# EAGLE design Djanso_DS_792 (EAGLE 9.6.2)
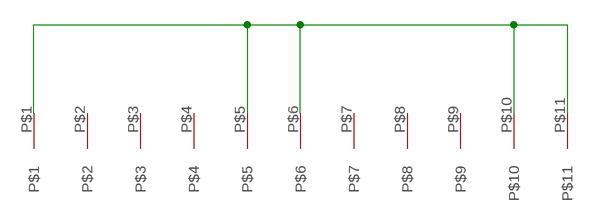
[diagram p0: schematic, sheet 1]

## Parts
U$1  ADVCHIP  [ADCHIP]

## Nets
N$1: U$1.P$1 U$1.P$5 U$1.P$6 U$1.P$10 U$1.P$11
Unconnected: U$1.P$2 U$1.P$3 U$1.P$4 U$1.P$7 U$1.P$8 U$1.P$9

## Library data of the parts
U$1 = advpins:ADVCHIP

## Board
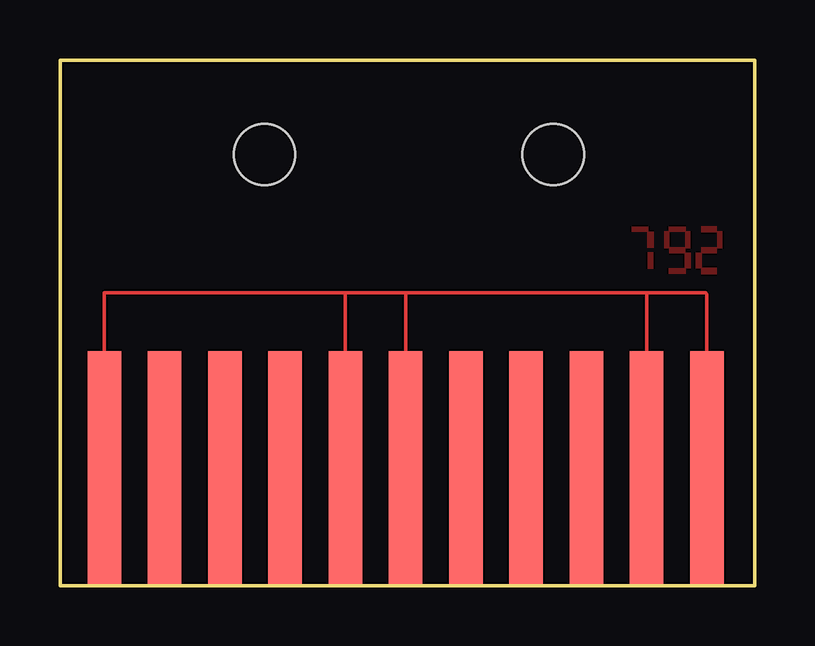
[diagram p1: board, top side]

Size 28.95 x 21.9 mm. Coordinates in mm from the lower left corner, seen from the top.
Outline: 0.05,0 28.95,0 28.95,21.9 0.05,21.9
Outline: 0,0 0,21.9
Copper layers (1*16): Top 0.035mm / dielectric 1.5mm / Bottom 0.035mm
Design rules "default *": minimum track width 6mil, minimum drill 0.35mm, track to track 0.25mil, track to pad 6mil, pad to pad 6mil, via to via 6mil, smd to smd 6mil, copper to edge 0.002540625mm, drill to drill 1mil, minimum pad ring 10mil, minimum via ring 8mil, stop-mask expansion 4mil, vias tented up to drill 0mil, thermal gap 10mil
Holes 2.56 mm at 8.52,17.96 20.55,17.96

### Footprints (pad centres in the part's own frame; a part is rotated, then mirrored left to right if it is on the bottom)
ADCHIP = smd 1.4 x 9.7: P$1 -27.61,5.02; P$2 -25.1,5.02; P$3 -22.59,5.02; P$4 -20.08,5.02; P$5 -17.57,5.02; P$6 -15.06,5.02; P$7 -12.55,5.02; P$8 -10.04,5.02; P$9 -7.53,5.02; P$10 -5.02,5.02; P$11 -2.51,5.02

### Placement (x,y rotation side)
U$1  29.46,-0.1 0 top

### Tracks (layer width: path | path; a pad name or v marks a point on that pad's centre or on a via)
N$1
  Top 0.152: U$1.P$1 1.85,12.2 11.95,12.2 | 11.95,12.2 14.4,12.2 | 14.4,12.2 24.45,12.2 | 24.45,12.2 26.9,12.2 26.95,12.15 U$1.P$11 | U$1.P$5 11.89,12.14 11.95,12.2 | U$1.P$6 14.4,12.2 | U$1.P$10 24.44,12.19 24.45,12.2
N$2
  pour Top (rank 4): 24.49,14.73 23.85,14.73 23.85,14.95 24.49,14.95
N$3
  pour Top (rank 4): 24.5,13.87 24.5,13.22 24.71,13.22 24.71,13.87
N$4
  pour Top (rank 4): 24.71,14.08 24.5,14.08 24.5,14.73 24.71,14.73
N$5
  pour Top (rank 4): 26.04,14.73 25.39,14.73 25.39,14.95 26.04,14.95
N$6
  pour Top (rank 4): 25.18,14.73 25.18,14.08 25.38,14.08 25.38,14.73
N$7
  pour Top (rank 4): 26.72,14.95 26.72,14.73 27.37,14.73 27.37,14.95
N$8
  pour Top (rank 4): 26.05,14.73 26.05,14.08 26.26,14.08 26.26,14.73
N$9
  pour Top (rank 4): 26.26,13.22 26.05,13.22 26.05,13.87 26.26,13.87
N$10
  pour Top (rank 4): 25.39,14.08 25.39,13.87 26.04,13.87 26.04,14.08
N$11
  pour Top (rank 4): 26.71,13.22 26.51,13.22 26.51,13.87 26.71,13.87
N$12
  pour Top (rank 4): 26.72,14.08 26.72,13.87 27.37,13.87 27.37,14.08
N$13
  pour Top (rank 4): 27.38,14.73 27.38,14.08 27.59,14.08 27.59,14.73
N$14
  pour Top (rank 4): 26.04,13 25.39,13 25.39,13.22 26.04,13.22
N$15
  pour Top (rank 4): 26.72,13.22 26.72,13 27.37,13 27.37,13.22